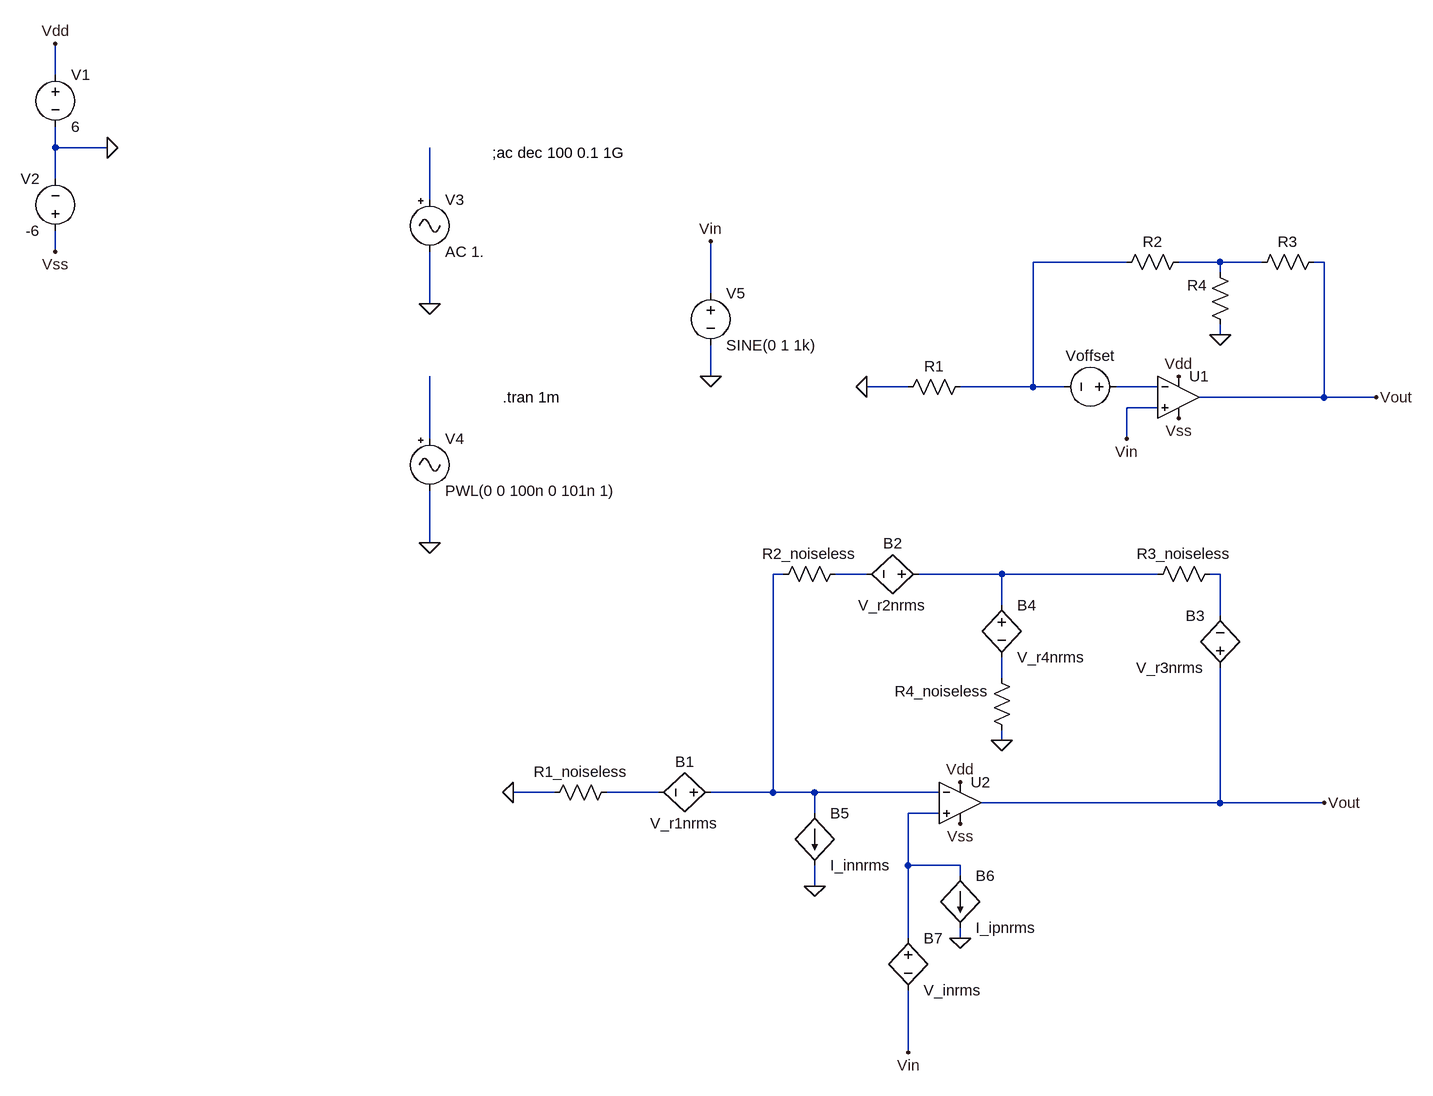
[diagram p0: schematic Ex1.asc]
Ex1.asc, the LTspice schematic file:
Version 4
SHEET 1 980 1192
WIRE -1360 -384 -1360 -432
WIRE -1360 -272 -1360 -304
WIRE -1280 -272 -1360 -272
WIRE -1360 -224 -1360 -272
WIRE -784 -192 -784 -272
WIRE -1360 -112 -1360 -144
WIRE 288 -96 144 -96
WIRE 432 -96 368 -96
WIRE 496 -96 432 -96
WIRE 592 -96 576 -96
WIRE 432 -80 432 -96
WIRE -352 -48 -352 -128
WIRE -784 -32 -784 -112
WIRE 432 16 432 0
WIRE -352 80 -352 32
WIRE -48 96 -112 96
WIRE 144 96 144 -96
WIRE 144 96 32 96
WIRE 192 96 144 96
WIRE 336 96 272 96
WIRE 592 112 592 -96
WIRE 592 112 400 112
WIRE 672 112 592 112
WIRE 336 128 288 128
WIRE -784 176 -784 80
WIRE 288 176 288 128
WIRE -784 336 -784 256
WIRE -240 384 -256 384
WIRE -112 384 -160 384
WIRE 96 384 -32 384
WIRE 336 384 96 384
WIRE 432 384 416 384
WIRE 96 432 96 384
WIRE 432 448 432 384
WIRE 96 544 96 512
WIRE 96 640 96 624
WIRE -592 720 -656 720
WIRE -432 720 -512 720
WIRE -256 720 -256 384
WIRE -256 720 -352 720
WIRE -192 720 -256 720
WIRE 0 720 -192 720
WIRE 432 736 432 528
WIRE 432 736 64 736
WIRE 592 736 432 736
WIRE -192 752 -192 720
WIRE 0 752 -48 752
WIRE -48 832 -48 752
WIRE 32 832 -48 832
WIRE 32 848 32 832
WIRE -192 864 -192 832
WIRE -48 944 -48 832
WIRE 32 944 32 928
WIRE -48 1120 -48 1024
FLAG -1280 -272 0
FLAG -1360 -112 Vss
FLAG -1360 -432 Vdd
FLAG 368 80 Vdd
FLAG 368 144 Vss
FLAG 672 112 Vout
FLAG -784 -32 0
FLAG -784 336 0
FLAG -112 96 0
FLAG 432 16 0
FLAG 288 176 Vin
FLAG -352 80 0
FLAG -352 -128 Vin
FLAG 32 704 Vdd
FLAG 32 768 Vss
FLAG 592 736 Vout
FLAG -656 720 0
FLAG 96 640 0
FLAG -48 1120 Vin
FLAG -192 864 0
FLAG 32 944 0
SYMBOL UniversalOpAmp2 368 112 R0
SYMATTR InstName U1
SYMBOL voltage -1360 -400 R0
SYMATTR InstName V1
SYMATTR Value 6
SYMBOL voltage -1360 -128 R180
WINDOW 0 24 96 Left 2
WINDOW 3 24 16 Left 2
SYMATTR InstName V2
SYMATTR Value -6
SYMBOL signal -784 -208 R0
SYMATTR InstName V3
SYMATTR Value AC 1.
SYMBOL signal -784 160 R0
WINDOW 123 24 132 Left 2
WINDOW 39 0 0 Left 0
SYMATTR InstName V4
SYMATTR Value PWL(0 0 100n 0 101n 1)
SYMBOL res 48 80 R90
WINDOW 0 0 56 VBottom 2
WINDOW 3 32 56 VTop 2
SYMATTR InstName R1
SYMATTR Value ""
SYMBOL res 384 -112 R90
WINDOW 0 0 56 VBottom 2
WINDOW 3 32 56 VTop 2
SYMATTR InstName R2
SYMATTR Value ""
SYMBOL res 448 16 R180
WINDOW 0 36 76 Left 2
WINDOW 3 36 40 Left 2
SYMATTR InstName R4
SYMATTR Value ""
SYMBOL res 480 -80 R270
WINDOW 0 32 56 VTop 2
WINDOW 3 0 56 VBottom 2
SYMATTR InstName R3
SYMATTR Value ""
SYMBOL Voltage -352 -64 R0
SYMATTR InstName V5
SYMATTR Value SINE(0 1 1k)
SYMBOL UniversalOpAmp2 32 736 R0
SYMATTR InstName U2
SYMBOL res -496 704 R90
WINDOW 0 0 56 VBottom 2
WINDOW 3 32 56 VTop 2
SYMATTR InstName R1_noiseless
SYMATTR Value ""
SYMBOL res -144 368 R90
WINDOW 0 0 56 VBottom 2
WINDOW 3 32 56 VTop 2
SYMATTR InstName R2_noiseless
SYMATTR Value ""
SYMBOL res 112 640 R180
WINDOW 0 36 76 Left 2
WINDOW 3 36 40 Left 2
SYMATTR InstName R4_noiseless
SYMATTR Value ""
SYMBOL res 320 400 R270
WINDOW 0 32 56 VTop 2
WINDOW 3 0 56 VBottom 2
SYMATTR InstName R3_noiseless
SYMATTR Value ""
SYMBOL bv -336 720 R90
WINDOW 0 -32 56 VBottom 2
WINDOW 3 32 56 VTop 2
SYMATTR InstName B1
SYMATTR Value V_r1nrms
SYMBOL bv -16 384 R90
WINDOW 0 -32 56 VBottom 2
WINDOW 3 32 56 VTop 2
SYMATTR InstName B2
SYMATTR Value V_r2nrms
SYMBOL bv 432 544 R180
WINDOW 0 24 96 Left 2
WINDOW 3 24 16 Left 2
SYMATTR InstName B3
SYMATTR Value V_r3nrms
SYMBOL bv 96 416 R0
SYMATTR InstName B4
SYMATTR Value V_r4nrms
SYMBOL bi -192 752 R0
SYMATTR InstName B5
SYMATTR Value I_innrms
SYMBOL bi 32 848 R0
SYMATTR InstName B6
SYMATTR Value I_ipnrms
SYMBOL bv -48 928 R0
SYMATTR InstName B7
SYMATTR Value V_inrms
SYMBOL Voltage 288 96 R90
WINDOW 0 -32 56 VBottom 2
WINDOW 3 32 56 VTop 2
SYMATTR InstName Voffset
SYMATTR Value ""
TEXT -688 -264 Left 2 !;ac dec 100 0.1 1G
TEXT -672 112 Left 2 !.tran 1m

The netlist it stands for:
* Ex1.asc
XU1 Vin N004 Vdd Vss Vout level2 Avol=1Meg GBW=10Meg Slew=10Meg Ilimit=25m Rail=0 Vos=0 En=0 Enk=0 In=0 Ink=0 Rin=500Meg  ; pins In+ In- V+ V- OUT
V1 Vdd 0 6
V2 Vss 0 -6
V3 N001 0 AC 1.
V4 N005 0 PWL(0 0 100n 0 101n 1)
R1 N002 0
R2 N003 N002
R4 0 N003
R3 N003 Vout
V5 Vin 0 SINE(0 1 1k)
XU2 N012 N006 Vdd Vss Vout level2 Avol=1Meg GBW=10Meg Slew=10Meg Ilimit=25m Rail=0 Vos=0 En=0 Enk=0 In=0 Ink=0 Rin=500Meg  ; pins In+ In- V+ V- OUT
R1_noiseless N011 0
R2_noiseless N007 N006
R4_noiseless 0 N010
R3_noiseless N008 N009
B1 N006 N011 V_r1nrms
B2 N008 N007 V_r2nrms
B3 Vout N009 V_r3nrms
B4 N008 N010 V_r4nrms
B5 N006 0 I_innrms
B6 N012 0 I_ipnrms
B7 N012 Vin V_inrms
Voffset N004 N002
;ac dec 100 0.1 1G
.tran 1m
.lib UniversalOpAmp2.lib
.backanno
.end